# Altium schematic sheet 10. eMMC.SchDoc
size A3
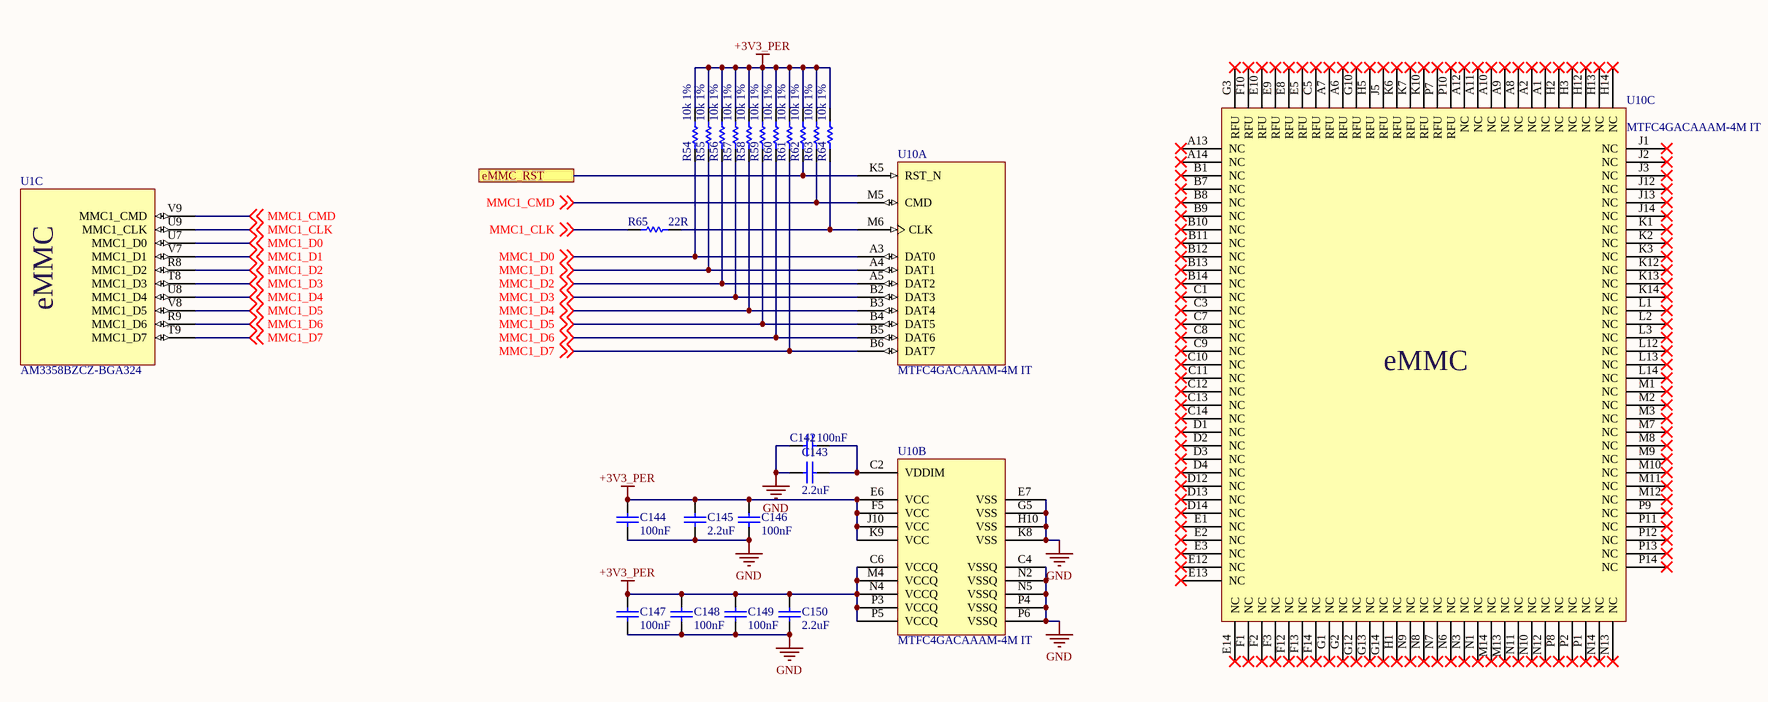
[diagram p0: 10. eMMC.SchDoc]

## Parts
C142  100nF  [CAPC1005X60X30LL05T10]
C143  2.2uF  [CAPC1608X90X35ML10T15]
C144  100nF  [CAPC1005X60X30LL05T10]
C145  2.2uF  [CAPC1005X60X30LL05T10]
C146  100nF  [CAPC1005X60X30LL05T10]
C147  100nF  [CAPC1005X60X30LL05T10]
C148  100nF  [CAPC1005X60X30LL05T10]
C149  100nF  [CAPC1005X60X30LL05T10]
C150  2.2uF  [CAPC1608X90X35ML10T15]
R54  10k 1%  [RESC1005X40X25LL05T05]
R55  10k 1%  [RESC1005X40X25LL05T05]
R56  10k 1%  [RESC1005X40X25LL05T05]
R57  10k 1%  [RESC1005X40X25LL05T05]
R58  10k 1%  [RESC1005X40X25LL05T05]
R59  10k 1%  [RESC1005X40X25LL05T05]
R60  10k 1%  [RESC1005X40X25LL05T05]
R61  10k 1%  [RESC1005X40X25LL05T05]
R62  10k 1%  [RESC1005X40X25LL05T05]
R63  10k 1%  [RESC1005X40X25LL05T05]
R64  10k 1%  [RESC1005X40X25LL05T05]
R65  22R  [RESC1005X40X25LL05T05]
U1  AM3358BZCZ-BGA324  [TI-ZCZ324]  (part C of 11)
U10  MTFC4GACAAAM-4M IT  [VFBGA-153]  (parts A,B,C of 3)

## Ports
eMMC_RST

## Nets
+3V3_PER: C144.2 C145.2 C146.2 C147.2 C148.2 C149.2 C150.2 R54.2 R55.2 R56.2 R57.2 R58.2 R59.2 R60.2 R61.2 R62.2 R63.2 R64.2 U10.C6(VCCQ) U10.E6(VCC) U10.F5(VCC) U10.J10(VCC) U10.K9(VCC) U10.M4(VCCQ) U10.N4(VCCQ) U10.P3(VCCQ) U10.P5(VCCQ)
GND: C142.2 C143.2 C144.1 C145.1 C146.1 C147.1 C148.1 C149.1 C150.1 U10.C4(VSSQ) U10.E7(VSS) U10.G5(VSS) U10.H10(VSS) U10.K8(VSS) U10.N2(VSSQ) U10.N5(VSSQ) U10.P4(VSSQ) U10.P6(VSSQ)
eMMC_RST: R62.1 U10.K5(RST_N) ; port eMMC_RST
MMC1_CLK: R65.1 U1.U9(MMC1_CLK) ; off-sheet MMC1_CLK
MMC1_CMD: R63.1 U1.V9(MMC1_CMD) U10.M5(CMD) ; off-sheet MMC1_CMD
MMC1_D0: R54.1 U1.U7(MMC1_D0) U10.A3(DAT0) ; off-sheet MMC1_D0
MMC1_D1: R55.1 U1.V7(MMC1_D1) U10.A4(DAT1) ; off-sheet MMC1_D1
MMC1_D2: R56.1 U1.R8(MMC1_D2) U10.A5(DAT2) ; off-sheet MMC1_D2
MMC1_D3: R57.1 U1.T8(MMC1_D3) U10.B2(DAT3) ; off-sheet MMC1_D3
MMC1_D4: R58.1 U1.U8(MMC1_D4) U10.B3(DAT4) ; off-sheet MMC1_D4
MMC1_D5: R59.1 U1.V8(MMC1_D5) U10.B4(DAT5) ; off-sheet MMC1_D5
MMC1_D6: R60.1 U1.R9(MMC1_D6) U10.B5(DAT6) ; off-sheet MMC1_D6
MMC1_D7: R61.1 U1.T9(MMC1_D7) U10.B6(DAT7) ; off-sheet MMC1_D7
NetC142_1: C142.1 C143.1 U10.C2(VDDIM)
NetR64_1: R64.1 R65.2 U10.M6(CLK)

Not connected (* = marked no-connect by the designer): U10 A1(NC)* A2(NC)* A6(RFU)* A7(RFU)* A8(NC)* A9(NC)* A10(NC)* A11(NC)* A12(NC)* A13(NC)* A14(NC)* B1(NC)* B7(NC)* B8(NC)* B9(NC)* B10(NC)* B11(NC)* B12(NC)* B13(NC)* B14(NC)* C1(NC)* C3(NC)* C5(RFU)* C7(NC)* C8(NC)* C9(NC)* C10(NC)* C11(NC)* C12(NC)* C13(NC)* C14(NC)* D1(NC)* D2(NC)* D3(NC)* D4(NC)* D12(NC)* D13(NC)* D14(NC)* E1(NC)* E2(NC)* E3(NC)* E5(RFU)* E8(RFU)* E9(RFU)* E10(RFU)* E12(NC)* E13(NC)* E14(NC)* F1(NC)* F2(NC)* F3(NC)* F10(RFU)* F12(NC)* F13(NC)* F14(NC)* G1(NC)* G2(NC)* G3(RFU)* G10(RFU)* G12(NC)* G13(NC)* G14(NC)* H1(NC)* H2(NC)* H3(NC)* H5(RFU)* H12(NC)* H13(NC)* H14(NC)* J1(NC)* J2(NC)* J3(NC)* J5(RFU)* J12(NC)* J13(NC)* J14(NC)* K1(NC)* K2(NC)* K3(NC)* K6(RFU)* K7(RFU)* K10(RFU)* K12(NC)* K13(NC)* K14(NC)* L1(NC)* L2(NC)* L3(NC)* L12(NC)* L13(NC)* L14(NC)* M1(NC)* M2(NC)* M3(NC)* M7(NC)* M8(NC)* M9(NC)* M10(NC)* M11(NC)* M12(NC)* M13(NC)* M14(NC)* N1(NC)* N3(NC)* N6(NC)* N7(NC)* N8(NC)* N9(NC)* N10(NC)* N11(NC)* N12(NC)* N13(NC)* N14(NC)* P1(NC)* P2(NC)* P7(RFU)* P8(NC)* P9(NC)* P10(RFU)* P11(NC)* P12(NC)* P13(NC)* P14(NC)*

## Notes on the sheet
- Title
- Size:
- Date:
- A4
- Number:
- Time:
- Revision:
- Sheet
- of
- N.S.T
- Design by:
- Check by:
- https://github.com/tung080827
- (in symbol AM3358BZCZ100, part C) eMMC
- (in symbol CMP-2000-05234-1, part C) eMMC

## Library data of the parts
C142 C144 C146-C149 = CMP-2100-03641-1: Chip Capacitor, 0.1 uF, +/- 10%, 16 V, -55 to 125 degC, 0402 (1005 Metric), RoHS, Tape and Reel; Manufacturer: Murata; Material: Ceramic; Insulation Resistance: 10GR; Voltage: 16V; Dielectric: X7R; REACH SVHC: NoSVHC; Depth: 0.5mm; Case/Package: 0402; Datasheet URL: http://psearch.en.murata.com/capacitor/product/GRM155R71C104KA88%23.pdf; Lead Free: LeadFree; Dielectric Material: Ceramic; Manufacturer URL: http://www.murata.com/; Min Operating Temperature: -55degC; Length: 1mm; Case Code (Metric): 1005; Radiation Hardening: No; Package Reference: 0402; RoHSCompliant: true; Datasheet Version: 42675.0; Thickness: 0.022inch; Packaging: TapeandReel; Voltage Rating (DC): 16V; Tolerance: 10%; Max Operating Temperature: 125degC; Package Description: 2-Pin Surface Mount Device, Body 1 x 0.5 mm; Mount: SurfaceMount; Height: 0.5mm; Width: 0.5mm; Number of Pins: 2; Voltage Rating: 16V; Case Code (Imperial): 0402; Termination: SMD/SMT; Capacitance: 100nF; Package Quantity: 1
C143 C145 C150 = CMP-2006-02836-1: CAP 2.2uF 10V ±10% 0603 (1608 Metric) Thickness 0.6mm SMD; Manufacturer: Murata; Part Number: GRM188R71A225KE15D
R54-R64 = CMP-2002-08135-1: 10k 0.063W 1% 0402 (1005 Metric)  SMD; Manufacturer: Vishay Dale; Part Number: CRCW040210K0FKED
R65 = CMP-1665-00027-3: Chip Resistor, 22 Ohm, +/- 1%, 0.1 W, -55 to 155 degC, 0402 (1005 Metric), RoHS, Tape and Reel; PartNumber: ERJ-2RKF22R0X; Case\/Package: 0402; Resistance: 22 Ohm; Power Rating: 100 mW; Voltage Rating: 50 V; ComponentLink2Description: Datasheet; Packaging: Tape and Reel; Weight: 2.8E-05oz; Pins: 2; Case Code (Imperial): 0402; Width: 0.5 mm; ComponentLink2URL: http://industrial.panasonic.com/cdbs/www-data/pdf/RDA0000/AOA0000C86.pdf; Height: 0.35 mm; PackageReference: 0402; REACH SVHC: Yes; Min Operating Temperature: -55 degC; Length: 1 mm; DatasheetVersion: 04/2015; RoHSCompliant: true; Package Quantity: 10000; Case Code (Metric): 1005; PackageDescription: 2-Pin Surface Mount Device, Body 1 x 0.5 mm; ComponentLink1URL: http://www.panasonic.com/; Mount: Surface Mount; Mounting Technology: Surface Mount; Tolerance: 1%; Max Operating Temperature: 155 degC; ComponentLink1Description: Manufacturer URL
U1 = AM3358BZCZ100: Sitara ARM Cortex-A8 32-Bit RISC Microprocessor, 1 GHz, SGX530 3D Graphics Engine, Programmable Real-Time Unit and Industrial Communication Subsystem (PRU-ICSS), 0 to 90 degC, 324-pin NFBGA (ZCZ), Green (RoHS & no Sb/Br); Supplier 1: Digi-Key
U10 = CMP-2000-05234-1: e·MMC Memory, 4 Gb, 2.7 to 3.6 V, -40 to 85 degC, 153-Ball VFBGA, RoHS; Manufacturer: Micron; Operating Supply Voltage: 3.3V; Max Processing Temp: 260; Lead Finish: Tin|Silver|Copper; Package Reference: VFBGA-153; Package Description: 153-Ball Very Fine Pitch Ball Grid Array, Body 13 x 11.5 mm, Pitch 0.5 mm; Datasheet Version: Rev. E, 06/2014; Operating Temperature: -40to85C; Mounting: SurfaceMount; Manufacturer URL: https://www.micron.com/; Package URL: http://download.siliconexpert.com/pdfs/2015/2/24/1/20/24/252/mic_/manual/emmc_ps8210_v451_80s_153b_it.pdf; Datasheet URL: http://download.siliconexpert.com/pdfs/2015/2/24/1/20/24/252/mic_/manual/emmc_ps8210_v451_80s_153b_it.pdf